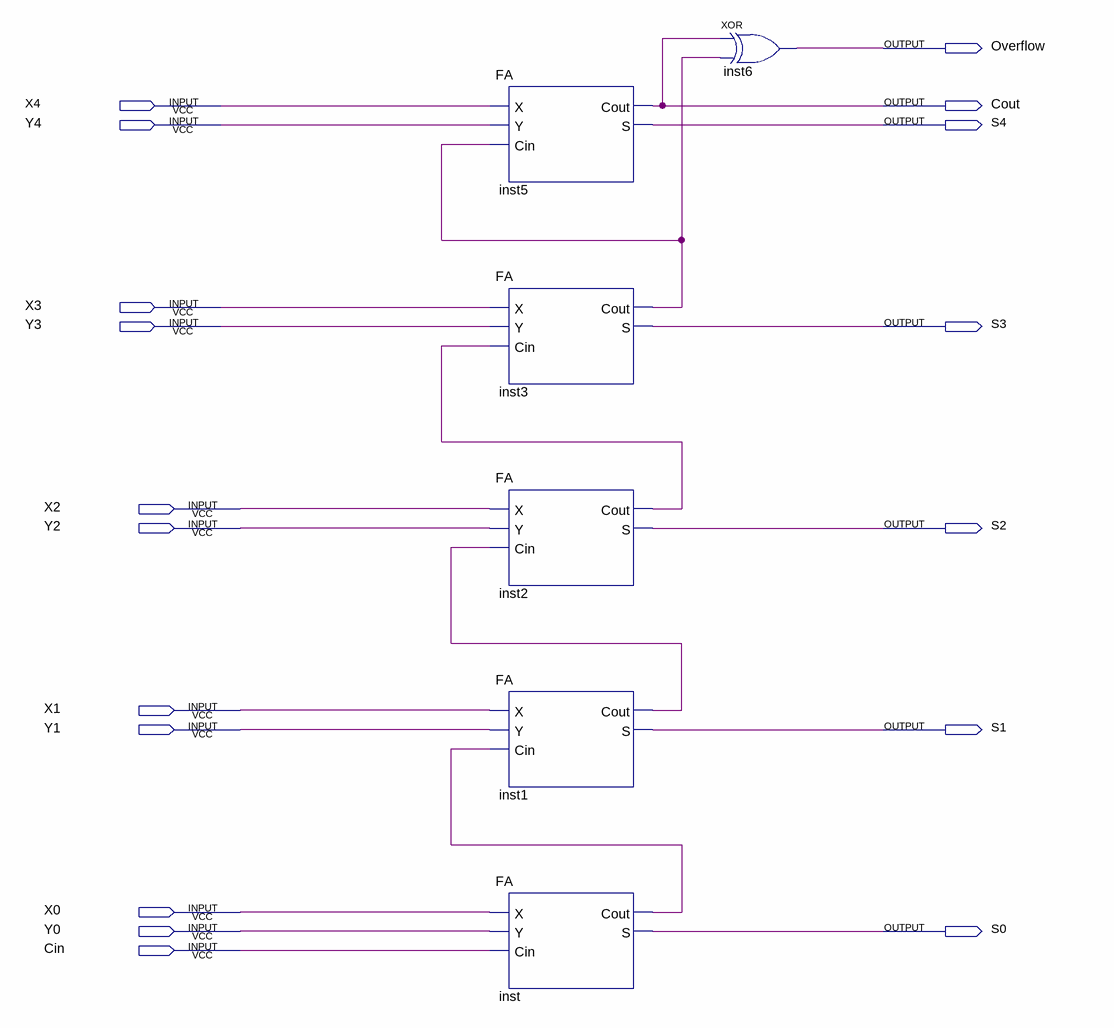
[diagram p0: schematic sheet]
// Quartus schematic adder_4bit.bdf as structural Verilog: 6 symbols, 18 pins
module adder_4bit (
  input  X4,
  input  Y4,
  input  X3,
  input  Y3,
  input  X2,
  input  Y2,
  input  X1,
  input  Y1,
  input  X0,
  input  Y0,
  input  Cin,
  output Overflow,
  output Cout,
  output S4,
  output S3,
  output S2,
  output S1,
  output S0
);

  wire inst1_cout, inst2_cout, inst3_cout, inst_cout;

  FA inst5 (.X(X4), .Y(Y4), .Cin(inst3_cout), .Cout(Cout), .S(S4));
  FA inst3 (.X(X3), .Y(Y3), .Cin(inst2_cout), .Cout(inst3_cout), .S(S3));
  FA inst2 (.X(X2), .Y(Y2), .Cin(inst1_cout), .Cout(inst2_cout), .S(S2));
  FA inst1 (.X(X1), .Y(Y1), .Cin(inst_cout), .Cout(inst1_cout), .S(S1));
  FA inst (.X(X0), .Y(Y0), .Cin(Cin), .Cout(inst_cout), .S(S0));
  xor inst6 (Overflow, Cout, inst3_cout);
endmodule
